# EAGLE design ZSLC (EAGLE 9.6.2)
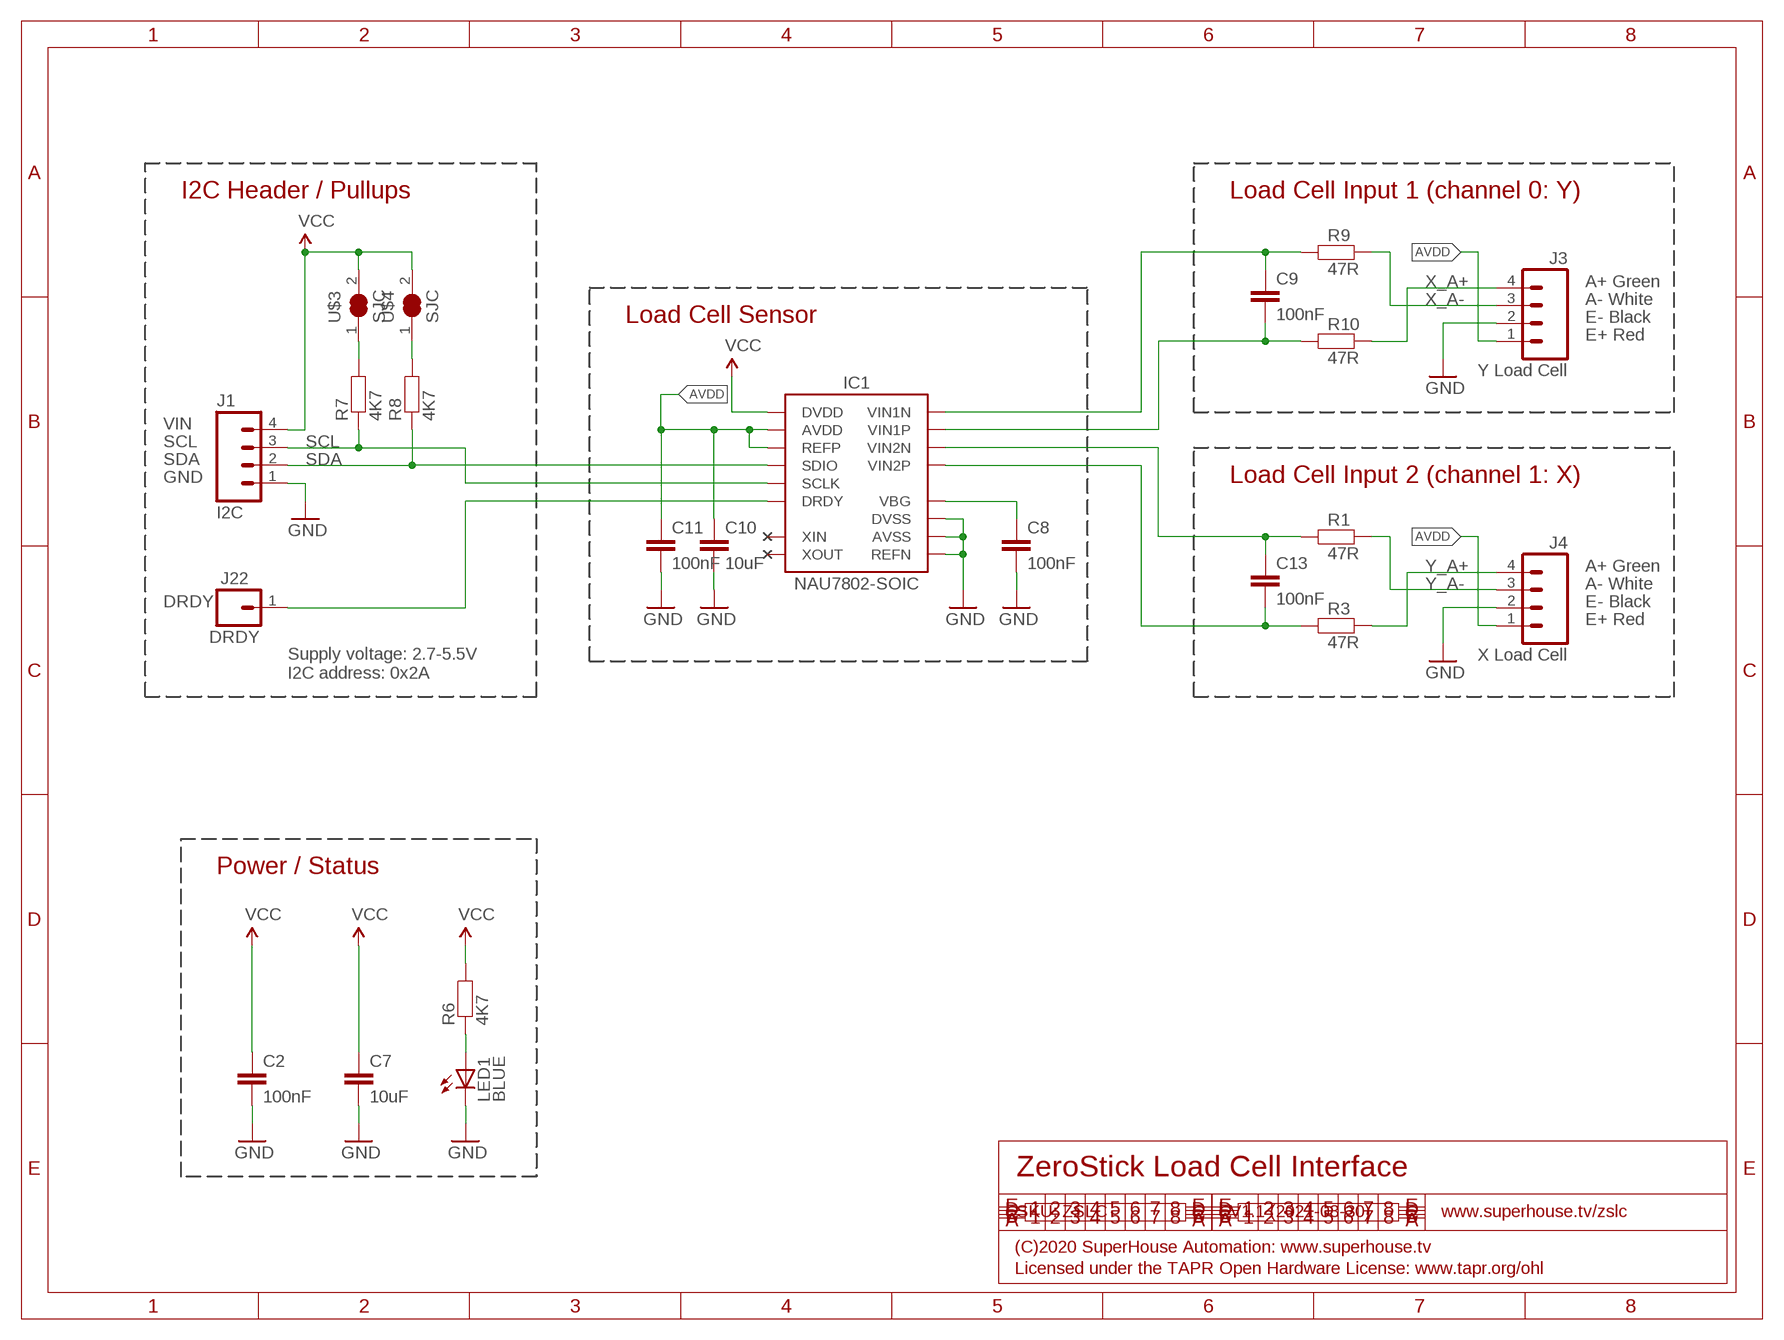
[diagram p0: schematic, sheet 1]

## Parts
C2  100nF  CAP0603  [C0603]
C7  10uF  CAP0805  [C0805]
C8  100nF  CAP0603  [C0603]
C9  100nF  CAP0603  [C0603]
C10  10uF  CAP0805  [C0805]
C11  100nF  CAP0603  [C0603]
C13  100nF  CAP0603  [C0603]
IC1  NAU7802-SOIC  [SO16]
J1  I2C  M04-PLAIN  [1X04]
J3  Y Load Cell  M04-1.27-PLAIN  [1X04-1.27-PLAIN]
J4  X Load Cell  M04-1.27-PLAIN  [1X04-1.27-PLAIN]
J22  DRDY  M01-PLAIN  [1X01]
LED1  BLUE  LED0603  [LED-0603]
R1  47R  RESISTOR0603  [R0603]
R3  47R  RESISTOR0603  [R0603]
R6  4K7  RESISTOR0603  [R0603]
R7  4K7  RESISTOR0603  [R0603]
R8  4K7  RESISTOR0603  [R0603]
R9  47R  RESISTOR0603  [R0603]
R10  47R  RESISTOR0603  [R0603]
U$3  SJC  SJC-NORMAL  [SJC]
U$4  SJC  SJC-NORMAL  [SJC]

## Nets
AVDD: C10.1 C11.1 IC1.1(REFP) IC1.16(AVDD) J3.1 J4.1
GND: C2.2 C7.2 C8.2 C10.2 C11.2 IC1.7(REFN) IC1.8(AVSS) IC1.9(DVSS) J1.1 J3.2 J4.2 LED1.C
N$1: IC1.12(DRDY) J22.1
N$2: C13.1 IC1.4(VIN2N) R1.1
N$4: C13.2 IC1.5(VIN2P) R3.1
N$5: LED1.A R6.1
N$6: C9.1 IC1.2(VIN1N) R9.1
N$7: C9.2 IC1.3(VIN1P) R10.1
N$8: C8.1 IC1.6(VBG)
N$11: R7.2 U$3.1
N$12: R8.2 U$4.1
SCL: IC1.13(SCLK) J1.3 R7.1
SDA: IC1.14(SDIO) J1.2 R8.1
VCC: C2.1 C7.1 IC1.15(DVDD) J1.4 R6.2 U$3.2 U$4.2
X_A+: J3.4 R10.2
X_A-: J3.3 R9.2
Y_A+: J4.4 R3.2
Y_A-: J4.3 R1.2
Unconnected: IC1.10(XIN) IC1.11(XOUT)

## Notes on the sheet
- I2C Header / Pullups | Load Cell Input 1 (channel 0: Y)
- A+ Green
- A- White
- Load Cell Sensor | E- Black
- E+ Red
- VIN
- SCL
- SDA
- GND | Load Cell Input 2 (channel 1: X)
- A+ Green
- A- White
- DRDY | E- Black
- E+ Red
- Supply voltage: 2.7-5.5V
  I2C address: 0x2A
- Power / Status
- ZeroStick Load Cell Interface
- SKU: ZSLC | V1.1 (2021-03-30) | www.superhouse.tv/zslc
- (C)2020 SuperHouse Automation: www.superhouse.tv
- Licensed under the TAPR Open Hardware License: www.tapr.org/ohl

## Library data of the parts
C2 C7-C11 C13 = SuperHouse-DiscreteSemi:CAP: Capacitor Standard ceramic capacitor
IC1 = SuperHouse-ICs:NAU7802: 24-bit load cell conversion IC with I2C interface in SOIC-16 package. Similar to HX711 but with true I2C interface.; PROD_ID: IC-14299
J1 J3 J4 = SuperHouse-Connectors:M04: 4-way header Standard 1x4 header, and screw terminal variations
J22 = SuperHouse-Connectors:M01: 1-way header Standard 1x1 header
LED1 = SuperHouse-LEDs:LED: LEDs Standard schematic elements and footprints for 5mm, 3mm, 1206, and 0603 sized LEDs. 5mm - Spark Fun Electronics SKU : COM-00529 (and others)
R1 R3 R6-R10 = SuperHouse-DiscreteSemi:RESISTOR: Resistors in both surface-mount and through-hole versions.
U$3 U$4 = SuperHouse-Jumpers:SJC: Solder jumper. Normally closed: does not need solder to close. Can be opened by cutting the track.

## Board
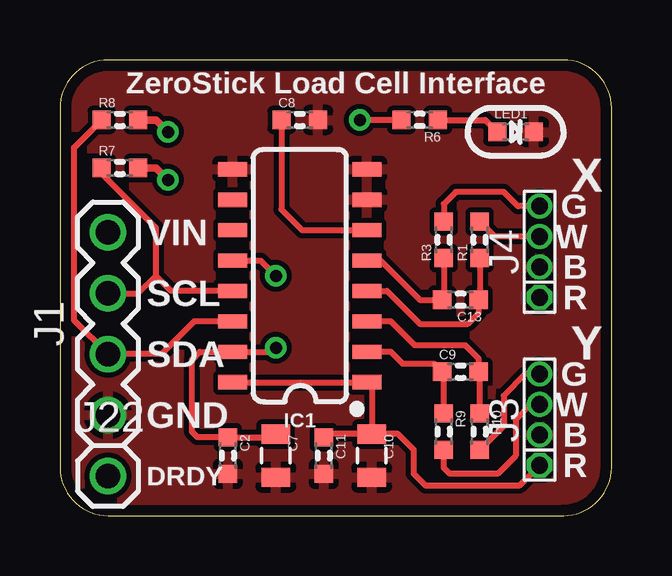
[diagram p1: board, top side]
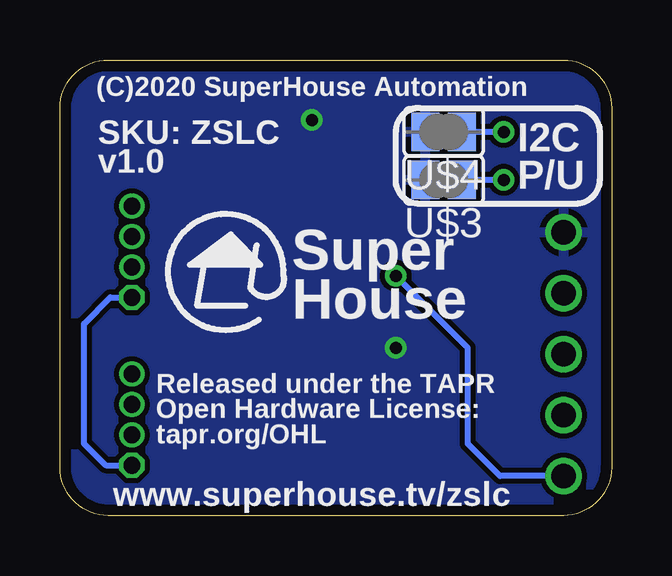
[diagram p2: board, bottom side, seen from below]

Size 23 x 19 mm. Coordinates in mm from the lower left corner, seen from the top.
Outline: 0,17 0,2 arc90 2,0 21,0 arc90 23,2 23,17 arc90 21,19 2,19 arc90 0,17
Copper layers (1*16): Top 0.035mm / dielectric 1.5mm / Bottom 0.035mm
Design rules "SuperHouse-Design-Rules": minimum track width 10mil, minimum drill 24mil, track to track 8mil, track to pad 8mil, pad to pad 8mil, via to via 8mil, smd to smd 6mil, copper to edge 18mil, drill to drill 8mil, minimum pad ring 7mil, minimum via ring 8mil, stop-mask expansion 4mil, vias tented up to drill 0.5mm, thermal gap 10mil

### Footprints (pad centres in the part's own frame; a part is rotated, then mirrored left to right if it is on the bottom)
C0603 = smd 0.762 x 0.762: 1 -0.762,0; 2 0.762,0
C0805 = smd 0.8 x 1.2: 1 -0.9,0; 2 0.9,0
SO16 = smd 0.6 x 1.2: 1 -4.445,-2.8; 2 -3.175,-2.8; 3 -1.905,-2.8; 4 -0.635,-2.8; 5 0.635,-2.8; 6 1.905,-2.8; 7 3.175,-2.8; 8 4.445,-2.8; 9 4.445,2.8; 10 3.175,2.8; 11 1.905,2.8; 12 0.635,2.8; 13 -0.635,2.8; 14 -1.905,2.8; 15 -3.175,2.8; 16 -4.445,2.8
1X04 = drill 1.016: 1 -3.81,0; 2 -1.27,0; 3 1.27,0; 4 3.81,0
1X04-1.27-PLAIN = drill 0.7 pad 1.016 octagon: 1 -1.905,0 | drill 0.7 pad 1.016: 2 -0.635,0; 3 0.635,0; 4 1.905,0
1X01 = drill 1.016: 1 0,0
LED-0603 = smd 0.762 x 0.762: A -0.762,0; C 0.762,0
R0603 = smd 0.762 x 0.762: 1 -0.762,0; 2 0.762,0
SJC = smd 1.168 x 1.6: 1 -0.762,0; 2 0.762,0

### Placement (x,y rotation side)
C2  7,2.5 270 top
C7  9,2.5 270 top
C8  10,16.5 0 top
C9  16.7,6 0 top
C10  13,2.5 270 top
C11  11,2.5 270 top
C13  16.7,9 180 top
IC1  10,10 90 top
J1  2,8 90 top
J3  20,4 90 top
J4  20,11 90 top
J22  2,1.65 0 top
LED1  19,16 0 top
R1  17.5,11.5 90 top
R3  16,11.5 90 top
R6  15,16.5 180 top
R7  2.5,14.5 0 top
R8  2.5,16.5 0 top
R9  16,3.5 270 top
R10  17.5,3.5 270 top
U$3  7,14 180 bottom
U$4  7,16 180 bottom

### Tracks (layer width: path | path; a pad name or v marks a point on that pad's centre or on a via)
AVDD
  Top 0.254: C11.1 11.14,3.4 C10.1 | IC1.16 IC1.1 13,5.36 C10.1 | C10.1 14.1,3.4 14.75,2.75 14.75,1.75 15.25,1.25 19.16,1.25 J3.1
  Bottom 0.254: J4.1 20.91,9.1 22,8 22,3 21.09,2.1 J3.1
GND
  pour Top: 23,17 23,2 arc-90 21,0 2,0 arc-90 0,2 0,17 arc-90 2,19 21,19 arc-90
N$1  (via drill 0.5)
  Top 0.254: IC1.12 8.37,10.63 v9,10
  Bottom 0.254: J22.1 4.65,1.65 6,3 6,7 v9,10
N$2
  Top 0.254: R1.1 17.5,9.04 C13.1 17.46,8.46 17,8 15,8 13.63,9.37 IC1.4
N$4
  Top 0.254: R3.1 16,9.06 C13.2 15,9 13.37,10.63 IC1.5
N$5
  Top 0.254: R6.1 17.74,16.5 LED1.A
N$6
  Top 0.254: R9.1 16,5.94 C9.1 15.61,6.33 14.3,6.33 13.8,6.83 IC1.2
N$7
  Top 0.254: R10.1 17.5,5.96 C9.2 17.46,6.54 16.91,7.09 14.8,7.09 13.8,8.1 IC1.3
N$8
  Top 0.254: C8.1 9.24,12.76 10.1,11.9 IC1.6
N$11  (via drill 0.5)
  Top 0.305: R7.2 4,14.5 v4.5,14
  Bottom 0.254: v4.5,14 U$3.1
N$12  (via drill 0.5)
  Top 0.305: v4.5,16 4,16.5 R8.2
  Bottom 0.254: v4.5,16 U$4.1
SCL
  Top 0.254: R7.1 1.74,14.26 4,12 4,10 | J1.3 3.27,9.27 4,10 | IC1.13 4.63,9.37 4,10
SDA
  Top 0.254: IC1.14 5.59,8.1 4.23,6.73 J1.2 0.58,8.15 0.58,15.35 R8.1
VCC  (via drill 0.5)
  Top 0.254: R6.2 v12.5,16.5 | C7.1 8.86,3.26 C2.1 5.74,3.26 5.5,3.5 5.5,6.5 5.83,6.83 IC1.15 8.82,6.83 v9,7
  pour Bottom: 23,17 23,2 arc-90 21,0 2,0 arc-90 0,2 0,17 arc-90 2,19 21,19 arc-90
X_A+
  Top 0.254: J3.4 19.41,5.91 18.5,5 18.5,3.74 R10.2
X_A-
  Top 0.254: J3.3 19.64,4.63 19,4 19,2.5 18.25,1.75 16.25,1.75 16,2 R9.2
Y_A+
  Top 0.254: J4.4 19.09,12.9 18.5,13.5 16.5,13.5 16,13 R3.2
Y_A-
  Top 0.254: J4.3 18.13,11.63 R1.2

### Text on the board
tPlace: ZeroStick Load Cell Interface | X | G | VIN | W | B | SCL | R | SDA | Y | G | W | GND | B | DRDY | R
bPlace: (C)2020 SuperHouse Automation | SKU: ZSLC | I2C / P/U | v1.0 | Super / House | Released under the TAPR / Open Hardware License: / tapr.org/OHL | www.superhouse.tv/zslc